# Altium schematic sheet TLM_002_SRC.SchDoc: =DocumentName
size A4; CompanyName: Scopa Industries LLC; Engineer: Nazar Lysenko / Andrii Antonenko; Organization: Scopa Industries LLC; Address1: Kyiv; Address2: Ukraine; Address3: https://www.scopa.industries/; Address4: oleksyi.y@scopa.industries; SheetNumber: 9; SheetTotal: 11
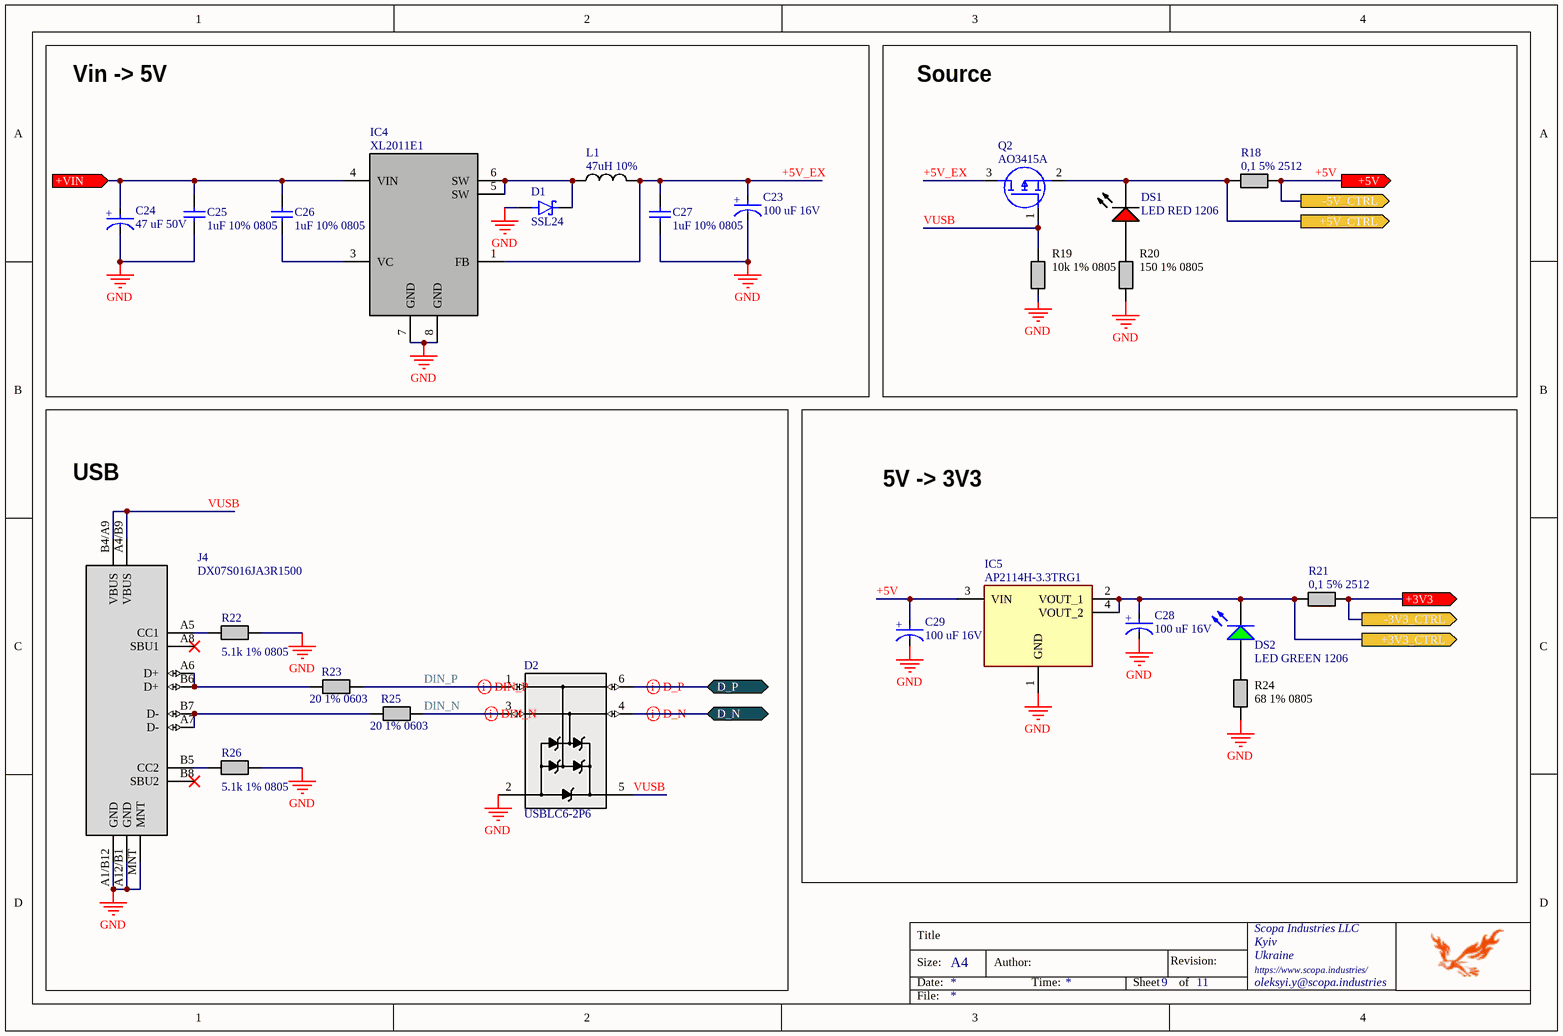
[diagram p0: TLM_002_SRC.SchDoc]

## Parts
C23  100 uF 16V  [FP-ZLG6_3X11-MFG]
C24  47 uF 50V  [FP-ZLG6_3X11-MFG]
C25  1uF 10% 0805  [CAPC2013X145X50NL20T20]
C26  1uF 10% 0805  [CAPC2013X145X50NL20T20]
C27  1uF 10% 0805  [CAPC2013X145X50NL20T20]
C28  100 uF 16V  [FP-ZLG6_3X11-MFG]
C29  100 uF 16V  [FP-ZLG6_3X11-MFG]
D1  SSL24  [DIO_SSL24]
D2  USBLC6-2P6  [FP-SOT-666-MFG]
DS1  LED RED 1206  [LUMX-SML-LX1206IC_V]
DS2  LED GREEN 1206  [LTST-C230KGKT_V]
IC4  XL2011E1  [SOIC127P600X175-8N]
IC5  AP2114H-3.3TRG1  [SOT230P700X180-4N]
J4  DX07S016JA3R1500  [FP-DX07S016JA3R1500-MFG]
L1  47uH 10%  [INDUCTOR 9MM]
Q2  AO3415A  [SOT95P280X125-3N]
R18  0,1 5% 2512  [RES_2512]
R19  10k 1% 0805  [RES_0805]
R20  150 1% 0805  [RES_0805]
R21  0,1 5% 2512  [RES_2512]
R22  5.1k 1% 0805  [RES_0805]
R23  20 1% 0603  [RES_0603]
R24  68 1% 0805  [RES_0805]
R25  20 1% 0603  [RES_0603]
R26  5.1k 1% 0805  [RES_0805]

## Ports
+3V3 (out, see TLM_002_MBR[2A], TLM_002_CONNECT[1A]), +3V3_CTRL (out, see TLM_002_MBR[2B]), +5V (out, see TLM_002_MBR[2A], TLM_002_CONNECT[1A]), +5V_CTRL (out, see TLM_002_MBR[2A]), +VIN (in, see TLM_002_MBR[1A]), -3V3_CTRL (out, see TLM_002_MBR[2B]), -5V_CTRL (out, see TLM_002_MBR[2B]), D_N (bidir, see TLM_002_MBR[2A], TLM_002_CONNECT[1B], TLM_002_ESP32S3[3A]), D_P (bidir, see TLM_002_MBR[2A], TLM_002_CONNECT[1B], TLM_002_ESP32S3[3A])

## Nets
GND: C23.1(C) C24.1(C) C25.1 C27.1 C28.1(C) C29.1(C) D1.A D2.2(GND) IC4.7(GND) IC4.8(GND) IC5.1(GND) J4.A1/B12(GND) J4.A12/B1(GND) J4.MNT R19.2 R20.2 R22.1 R24.2 R26.1
+3V3: R21.1 ; port +3V3, port -3V3_CTRL
+3V3_CTRL: C28.2(A) DS2.2(K) IC5.2(VOUT_1) IC5.4(VOUT_2) R21.2 ; port +3V3_CTRL
+5V: C29.2(A) IC5.3(VIN) R18.1 ; port +5V, port -5V_CTRL
+5V_CTRL: DS1.2(K) Q2.2(S) R18.2 ; port +5V_CTRL
+5V_EX: C23.2(A) C27.2 IC4.1(FB) L1.2 Q2.3(D)
+VIN: C24.2(A) C25.2 C26.2 IC4.4(VIN) ; port +VIN
D_N: D2.4(I/O2) ; port D_N
D_P: D2.6(I/O1) ; port D_P
DIN_N: D2.3(I/O2) R25.2
DIN_P: D2.1(I/O1) R23.2
VUSB: D2.5(VBUS) J4.A4/B9(VBUS) J4.B4/A9(VBUS) Q2.1(G) R19.1
NetC26_1: C26.1 IC4.3(VC)
NetD1_C: D1.C(K) IC4.5(SW) IC4.6(SW) L1.1
NetDS1_1: DS1.1(A) R20.1
NetDS2_1: DS2.1(A) R24.1
NetJ4_A5: J4.A5(CC1) R22.2
NetJ4_A6: J4.A6(D+) J4.B6(D+) R23.1
NetJ4_A7: J4.A7(D-) J4.B7(D-) R25.1
NetJ4_B5: J4.B5(CC2) R26.2

Not connected (* = marked no-connect by the designer): J4 A8(SBU1)* B8(SBU2)*

## Layout directives
differential pair: D_N, D_P, DIN_N, DIN_P

## Notes on the sheet
- Vin -> 5V
- Source switching
- USB
- 5V -> 3V3
- Title
- Size:
- Date:
- A4
- Author:
- Time:
- Sheet
- Revision:
- of
- File:
- (in symbol CMP-35376-000012-1) +

## Library data of the parts
C23 C28 C29 = CMP-35376-000012-1: CAP ALUM 100UF 16V RADIAL; Dielectric Material: Aluminium; Tolerance: 20%; Impedance: 65mR; Ripple Current: 760mA; Life (Hours): 2000Hour; Case/Package: Radial; Capacitance: 100uF; Diameter: 6.3mm; Min Operating Temperature: -40°C; Packaging: Bulk; Max Operating Temperature: 105°C; Height: 11mm; Radiation Hardening: No; Series: ZLG; Voltage Rating: 16V; Lead Pitch: 2.5mm; Lead Free: Lead Free; Height - Seated (Max): 0.492inch; Mount: Through Hole; Package Quantity: 3000; Termination: Radial; RoHS Compliant: Yes
C24 = CMP-35376-000012-1: CAP ALUM 47UF 50V RADIAL; Dielectric Material: Aluminium; Tolerance: 20%; Impedance: 65mR; Ripple Current: 760mA; Voltage Rating: 16V; Life (Hours): 2000Hour; Case/Package: Radial; Capacitance: 47uF; Diameter: 6.3mm; Min Operating Temperature: -40°C; Packaging: Bulk; Max Operating Temperature: 105°C; Height: 11mm; Radiation Hardening: No; Series: ZLG; Lead Pitch: 2.5mm; Lead Free: Lead Free; Height - Seated (Max): 0.492inch; Mount: Through Hole; Package Quantity: 3000; Termination: Radial; RoHS Compliant: Yes
C25-C27 = CMP-2007-01676-1: Part Number: VJ0805Y105KXQRW1BC; Manufacturer: Vitramon
D1 = SSL24: 2A, 40V, Schottky Rectifier; MF: Taiwan Semiconductor; SnapEDA_Link: https://www.snapeda.com/parts/SSL24/taiwan/view-part/?ref=snap; Package: SMB-2 Taiwan Semiconductor; Value: *; MP: SSL24; Check_prices: https://www.snapeda.com/parts/SSL24/taiwan/view-part/?ref=eda
D2 = CMP-00001-1: ESD Suppressors / TVS Diodes High Speed Interface Protection Low Cap; Leakage Current: 150nA; Number of Channels: 2; Direction: Unidirectional; Power Line Protection: Yes; Forward Voltage: 1.1V; Max Breakdown Voltage: 6V; Value: 2.5pF; Test Current: 1mA; Reverse Standoff Voltage: 5V; Number of Elements: 1; Max Junction Temperature (Tj): 125°C; Peak Pulse Current: 5A; Max Repetitive Reverse Voltage (Vrrm): 5.25V; Clamping Voltage: 17V; Element Configuration: Dual; Lifecycle Status: Production; Max Operating Temperature: 125°C; Number of Terminals: 6; RoHS: Compliant; Termination: SMD/SMT; Contact Plating: Tin; Depth: 1.3mm; Number of Bidirectional Channels: 2; Max Reverse Leakage Current: 150nA; Breakdown Voltage: 6V; Width: 1.3mm; Lead Free: Lead Free; Min Operating Temperature: -40°C; REACH SVHC: Yes; ESD Protection: Yes; Peak Reverse Current: 150nA; China RoHS: Compliant; Mounting Technology: Surface Mount; Height: 600µm; Reverse Breakdown Voltage: 6V; Case/Package: SOT-666; Schedule B: 8536300000, 8536300000; Radiation Hardening: No; Length: 1.7mm; Working Voltage: 5V; Min Breakdown Voltage: 6V; Pins: 6; Polarity: Unidirectional
DS1 = CMP-2000-07123-1: LED Red, 65 mW, -40 to 85 degC, 2-Pin SMD, RoHS, Tape and Reel; Manufacturer: Lumex; Part No: SML-LX1206IC-TR; LED Material: GaAsP; Peak Wavelength: 635nm; Number of LEDs: 1; Viewing Angle: 160; Reverse Voltage: 5(Min)V; Lens Appearance: ColorlessNonDiffused; Intensity: 6mcd; Type: Uni-Color; Pin_Count: 2; Lens Dimensions: 2x1.6x0.5mm; Mounting: SurfaceMount; ECCN: EAR99; RoHS: Unknown; Package Description: 2-Pin Surface Mount Device, Body 3.2 x 1.5 mm; Mounting Technology: SurfaceMount; Dominant Wavelength: N/A; Supplier_Package: SMD; Supplier Standard Pack: 3,000; Color: Red; Dimension: 3.2x1.6x1.1mm; HTS: 8541402000; Family: SML-LX1206IC; Supplier: Lumex; Datasheet URL: http://www.lumex.com/content/files/ProductAttachment/SML-LX1206IC-TR.pdf; Package Reference: SML-LX1206IC; Manufacturer URL: http://www.lumexinstruments.com/; Operating Temperature: -25to85C; Packaging: TapeandReel; Datasheet Version: Rev. J, 08/2012
DS2 = CMP-2000-06625-1: LED Green, 75 mW, 30 mA, -30 to 85 degC, 2-Pin SMD, RoHS, Tape and Reel; Manufacturer: Lite-On; Product Length (mm): 3.2mm; Type: Uni-Color; Peak Wavelength: 574nm; Shape Type: Rectangular; DELETED: Compliant; Lum Intensity: 35mcd; Forward Voltage: 2.4V; High Brightness: Yes; Rad Hardened: No; Power Dissipation: 75W; Forward Current: 30mA; Emitting Color: YellowGreen; Main Category: ChipLED; Product Height (mm): 1.1mm; Product Depth (mm): 1.6mm; Number of  Elements: 1; Viewing Angle: 130deg; Chip Material: AlGaInP; Dominant Wave Length: 571nm; Test Current (It): 20mA; Reverse Voltage: 5V; Mounting: SurfaceMount; Datasheet URL: http://optoelectronics.liteon.com/upload/download/DS22-2000-256/S_110_LTST-C230KGKT.pdf; Luminous Intensity: 35mcd; Pin Count: 2; Mounting Technology: SurfaceMount; Operating Temperature Classification: Industrial; Operating Temp Range: -55Cto85C; Package Type: ChipLed; Manufacturer URL: http://www.us.liteon.com/; Package Description: 2-Pin Surface Mount Device, Body 3.2 x 1.6 mm; Package Reference: C230KGKT; Datasheet Version: Rev. G, 12/2014; Lens Dimensions: 1.5X1.6X0.82mm; Packaging: TapeandReel
IC4 = XL2011E1: Integrated Circuit; Manufacturer_Name: Texas Instruments; Manufacturer_Part_Number: NE555DR; Datasheet Link: http://www.ti.com/lit/ds/symlink/ne555.pdf; Height: 1.75mm; Mouser Part Number: 595-NE555DR; Mouser Price/Stock: https://www.mouser.com/Search/Refine.aspx?Keyword=595-NE555DR; RS Part Number: 1218414; RS Price/Stock: http://uk.rs-online.com/web/p/products/1218414
IC5 = AP2114H-3.3TRG1: Integrated Circuit; Manufacturer_Name: Diodes Incorporated; Datasheet Link: https://www.diodes.com//assets/Datasheets/AP2114.pdf; Height: 1.8mm; Manufacturer_Part_Number: AP2114H-3.3TRG1; Mouser Part Number: 621-AP2114H-3.3TRG1; Mouser Price/Stock: https://www.mouser.co.uk/ProductDetail/Diodes-Incorporated/AP2114H-3.3TRG1?qs=x6A8l6qLYDDSG%2FfwzcsOhw%3D%3D; Arrow Part Number: AP2114H-3.3TRG1; Arrow Price/Stock: https://www.arrow.com/en/products/ap2114h-3.3trg1/diodes-incorporated?utm_currency=USD&region=nac
J4 = CMP-00000-2: Receptacle, 16 Position, 1-Row SMT, without Rear Shield, Shell-DIP Length 1.2mm; Number of Contacts: 16; USB Standard: USB 2.0; Voltage Rating: 20V; Current Rating: 6.25A; Lifecycle Status: Production; Min Operating Temperature: -40°C; Contact Material: Gold, Nickel; Height: 3.31mm; Max Operating Temperature: 85°C; REACH SVHC: Yes; RoHS: Compliant
L1 = Inductor_470k
Q2 = AO3415A: MOSFET (P-Channel); Manufacturer_Name: Alpha & Omega Semiconductors; Datasheet Link: http://www.aosmd.com/pdfs/datasheet/AO3415A.pdf; Height: 1.25mm; Manufacturer_Part_Number: AO3415A; Arrow Part Number: AO3415A; Arrow Price/Stock: https://www.arrow.com/en/products/ao3415a/alpha-and-omega-semiconductor?utm_currency=USD&region=europe
R18 R21 = Resistor_0,1: Resistor 0,1 Ohm 5% SMD 2512 Generic; Tolerance: 1%; Value: 10k; Package size: 0805
R19 = Resistor_10k: Resistor 10kOhm 1% SMD 0805 Generic; Package size: 0805; Tolerance: 1%; Value: 10k
R20 = Resistor_10k: Resistor 150 Ohm 1% SMD 0805 Generic; Value: 150; Package size: 0805; Tolerance: 1%
R22 R26 = Resistor_1k: Resistor 5.1kOhm 1% SMD 0805 Generic; Package size: 0805; Tolerance: 1%; Value: 5.1k
R23 R25 = Resistor_20: Resistor 20Ohm 1% SMD 0603 Generic; Value: 20; Package size: 0805; Tolerance: 1%
R24 = Resistor_10k: Resistor 68 Ohm 1% SMD 0805 Generic; Value: 68; Package size: 0805; Tolerance: 1%